# EAGLE schematic projeto_final (EAGLE 9.3.1)
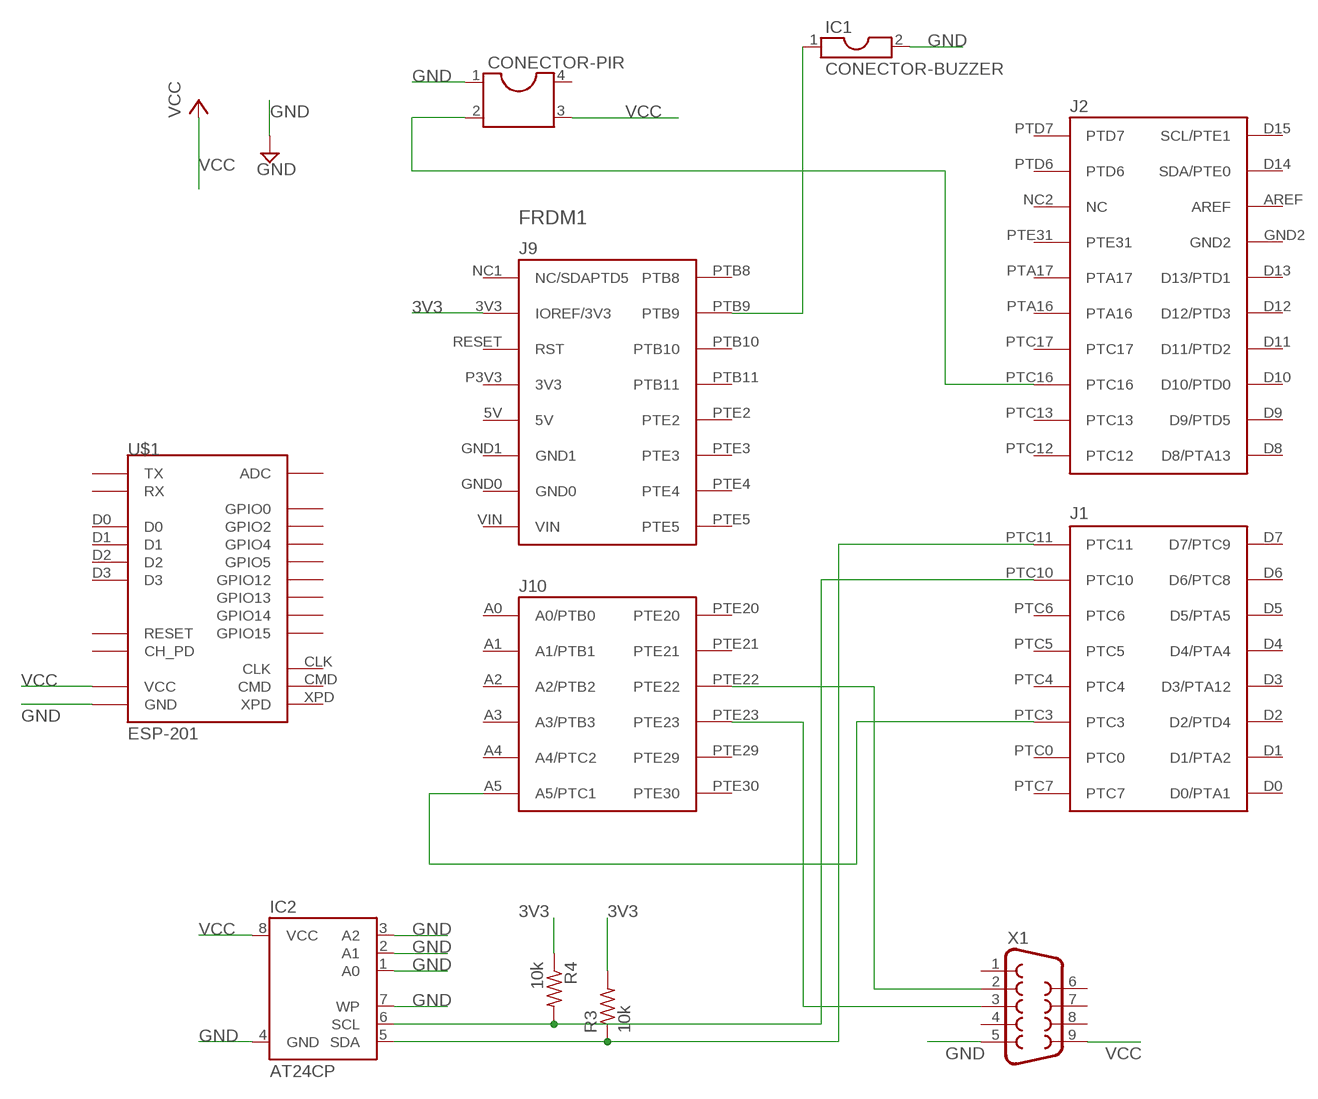
[diagram p0: schematic, sheet 1]

## Parts
CONECTOR-PIR  DIL4  [DIL04]
FRDM1  FRDM-KL25ZNORMAL  [FRDM_KL25Z_NORMAL]
IC1  CONECTOR-BUZZER  DIL2  [DIL02]
IC2  AT24CP  [DIL08]
R3  10k  R-US_0204/2V  [0204V]
R4  10k  R-US_0204/2V  [0204V]
U$1  ESP-201  [ESP-201]
X1  F09D  [F09D]

## Nets
3V3: FRDM1.3V3(IOREF/3V3) R3.2 R4.1
GND: CONECTOR-PIR.1 IC1.2 IC2.1(A0) IC2.2(A1) IC2.3(A2) IC2.4(GND) IC2.7(WP) U$1.GND U$1.GND_2(GND) U$1.GND_3(GND) X1.5
N$1: FRDM1.A5(A5/PTC1) FRDM1.PTC3
N$2: FRDM1.PTB9 IC1.1
N$3: CONECTOR-PIR.2 FRDM1.PTC16
N$7: FRDM1.PTE22 X1.2
N$8: FRDM1.PTC11 IC2.5(SDA) R3.1
N$9: FRDM1.PTC10 IC2.6(SCL) R4.2
N$16: FRDM1.PTE23 X1.3
VCC: CONECTOR-PIR.3 IC2.8(VCC) U$1.3V3(VCC) U$1.3V3_2(VCC) U$1.3V3_3(VCC) X1.9
Unconnected: CONECTOR-PIR.4 FRDM1.5V FRDM1.A0(A0/PTB0) FRDM1.A1(A1/PTB1) FRDM1.A2(A2/PTB2) FRDM1.A3(A3/PTB3) FRDM1.A4(A4/PTC2) FRDM1.AREF FRDM1.D0(D0/PTA1) FRDM1.D1(D1/PTA2) FRDM1.D2(D2/PTD4) FRDM1.D3(D3/PTA12) FRDM1.D4(D4/PTA4) FRDM1.D5(D5/PTA5) FRDM1.D6(D6/PTC8) FRDM1.D7(D7/PTC9) FRDM1.D8(D8/PTA13) FRDM1.D9(D9/PTD5) FRDM1.D10(D10/PTD0) FRDM1.D11(D11/PTD2) FRDM1.D12(D12/PTD3) FRDM1.D13(D13/PTD1) FRDM1.D14(SDA/PTE0) FRDM1.D15(SCL/PTE1) FRDM1.GND0 FRDM1.GND1 FRDM1.GND2 FRDM1.NC1(NC/SDAPTD5) FRDM1.NC2(NC) FRDM1.P3V3(3V3) FRDM1.PTA16 FRDM1.PTA17 FRDM1.PTB8 FRDM1.PTB10 FRDM1.PTB11 FRDM1.PTC0 FRDM1.PTC4 FRDM1.PTC5 FRDM1.PTC6 FRDM1.PTC7 FRDM1.PTC12 FRDM1.PTC13 FRDM1.PTC17 FRDM1.PTD6 FRDM1.PTD7 FRDM1.PTE2 FRDM1.PTE3 FRDM1.PTE4 FRDM1.PTE5 FRDM1.PTE20 FRDM1.PTE21 FRDM1.PTE29 FRDM1.PTE30 FRDM1.PTE31 FRDM1.RESET(RST) FRDM1.VIN U$1.ADC U$1.CH_PD U$1.CLK U$1.CMD U$1.D0 U$1.D1 U$1.D2 U$1.D3 U$1.GPIO0 U$1.GPIO2 U$1.GPIO4 U$1.GPIO5 U$1.GPIO12 U$1.GPIO13 U$1.GPIO14 U$1.GPIO15 U$1.RST(RESET) U$1.RX U$1.TX U$1.XPD X1.1 X1.4 X1.6 X1.7 X1.8

## Library data of the parts
CONECTOR-PIR = ic-package:DIL4: Dual In Line / Socket
FRDM1 = Freedom:FRDM-KL25Z: For creating FRDM-KL25Z shields
IC1 = ic-package:DIL2: Dual In Line
IC2 = atmel:AT24C*: 2-wire serial EEPROM; MPN: AT24C1024BW-SH-B; OC_FARNELL: 1362646; OC_NEWARK: 03P2044
R3 R4 = rcl:R-US_: RESISTOR, American symbol; SPICEPREFIX: R
U$1 = esp8266modules:ESP-201: ESP8266 Wifi Module ESP-201; DIMENSIONS: 25 x 35 mm; PINS: 26; PITCH: 0.1" / 2.54 mm
X1 = con-subd:F09: SUB-D; OC_FARNELL: unknown; OC_NEWARK: unknown